# Altium schematic sheet Aux_Inputs.SchDoc: RP2040 CNC
size B; Author: AM; CompanyName: Expatria Technologies; DrawnBy: A.Marles; Engineer: AM; Organization: Expatria Technolgoies; DocumentNumber: 7; SheetNumber: 7; SheetTotal: 14
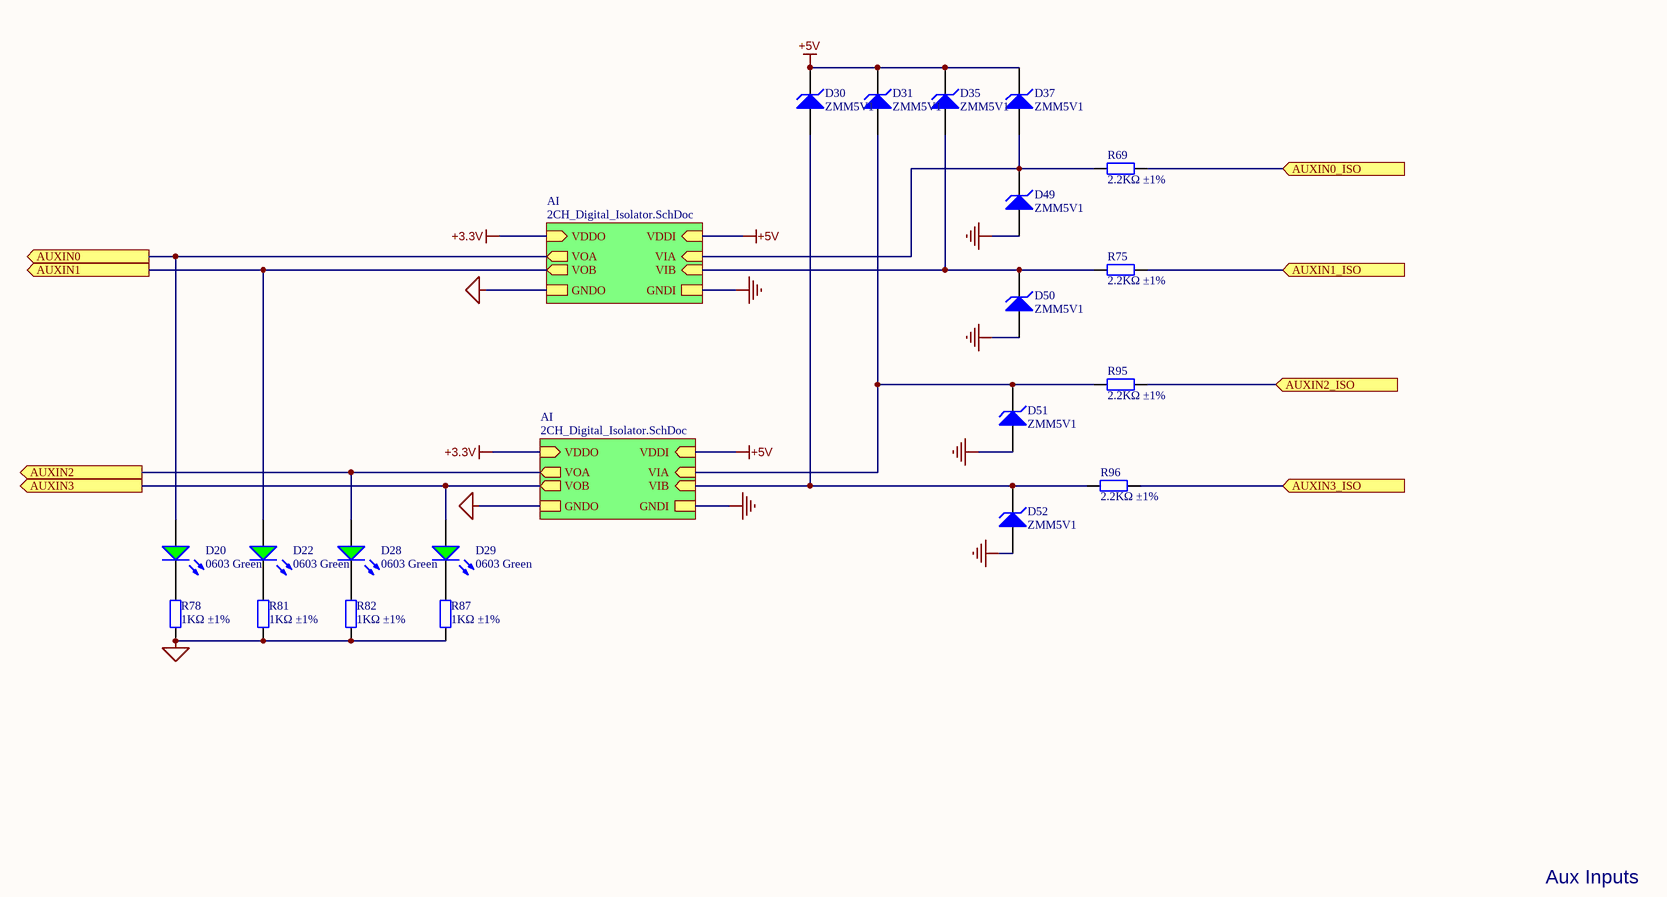
[diagram p0: Aux_Inputs.SchDoc]

## Parts
D20  0603 Green  [0603_LED_S1]
D22  0603 Green  [0603_LED_S1]
D28  0603 Green  [0603_LED_S1]
D29  0603 Green  [0603_LED_S1]
D30  ZMM5V1  [LL-34]
D31  ZMM5V1  [LL-34]
D35  ZMM5V1  [LL-34]
D37  ZMM5V1  [LL-34]
D49  ZMM5V1  [LL-34]
D50  ZMM5V1  [LL-34]
D51  ZMM5V1  [LL-34]
D52  ZMM5V1  [LL-34]
R69  2.2KΩ ±1%  [0603_R]
R75  2.2KΩ ±1%  [0603_R]
R78  1KΩ ±1%  [0603_R]
R81  1KΩ ±1%  [0603_R]
R82  1KΩ ±1%  [0603_R]
R87  1KΩ ±1%  [0603_R]
R95  2.2KΩ ±1%  [0603_R]
R96  2.2KΩ ±1%  [0603_R]

## Sub-sheets
AI = 2CH_Digital_Isolator.SchDoc: VDDO (in), VIB (in), VIA (in), VOB (out), VOA (out), VDDI (in), GNDO, GNDI
AI = 2CH_Digital_Isolator.SchDoc: VDDO (in), VIB (in), VIA (in), VOB (out), VOA (out), VDDI (in), GNDO, GNDI

## Ports
AUXIN0 (out), AUXIN0_ISO (in), AUXIN1 (out), AUXIN1_ISO (in), AUXIN2 (out), AUXIN2_ISO (in), AUXIN3 (out), AUXIN3_ISO (in)

## Nets
+3.3V: sheet AI/VDDO, sheet AI/VDDO
+5V: D30.2(K) D31.2(K) D35.2(K) D37.2(K) ; sheet AI/VDDI, sheet AI/VDDI
GND: D49.1(A) D50.1(A) D51.1(A) D52.1(A) ; sheet AI/GNDI, sheet AI/GNDI
MCU_GND: R78.2 R81.2 R82.2 R87.2 ; sheet AI/GNDO, sheet AI/GNDO
AUXIN0: D20.A ; port AUXIN0, sheet AI/VOA
AUXIN0_ISO: R69.1 ; port AUXIN0_ISO
AUXIN1: D22.A ; port AUXIN1, sheet AI/VOB
AUXIN1_ISO: R75.1 ; port AUXIN1_ISO
AUXIN2: D28.A ; port AUXIN2, sheet AI/VOA
AUXIN2_ISO: R95.1 ; port AUXIN2_ISO
AUXIN3: D29.A ; port AUXIN3, sheet AI/VOB
AUXIN3_ISO: R96.1 ; port AUXIN3_ISO
NetD20_K: D20.K R78.1
NetD22_K: D22.K R81.1
NetD28_K: D28.K R82.1
NetD29_K: D29.K R87.1
NetD30_1: D30.1(A) D52.2(K) R96.2 ; sheet AI/VIB
NetD31_1: D31.1(A) D51.2(K) R95.2 ; sheet AI/VIA
NetD35_1: D35.1(A) D50.2(K) R75.2 ; sheet AI/VIB
NetD37_1: D37.1(A) D49.2(K) R69.2 ; sheet AI/VIA

## Notes on the sheet
- Aux Inputs
- SHEET
- Expatria Technologies
- 1136 Glade Court
- Port Coquitlam, BC V3B 1R5
- PROJECT
- SIZE
- ENGR
- MODIFIED
- DOCUMENT
- REV
- Copyright Expatria Technologies 2022. This document describes Open Hardware and is licensed under the CERN-OHL-S v2. No warranty is implied or expressed.
- EMAIL: INFO@EXPATRIA.CA
- B
- /

## Library data of the parts
D20 D22 D28 D29 = 0603 LED Green: LED; ComponentLink1Description: 供应商链接; ComponentLink1URL: http://www.szlcsc.com/product/details_73152.html; Package: 0603; Supplier: LC; SuppliersPartNumber: C72043; Color: Green
D30 D31 D35 D37 D49-D52 = LL-34 ZMM5V6: 500mW - 0.1uA @ 1V 5.1V LL-34 Zener Diodes ROHS; ComponentLink1Description: 供应商链接; ComponentLink1URL: http://www.szlcsc.com/product/details_8541.html; Package: LL-34; Supplier: LC; SuppliersPartNumber: C2982194
R69 R75 R95 R96 = 0603 2.2K (2201) 1%: Chip resistor; Manufacturer: Uniroyal Elec; PartNumber: 0603WAF2201T5E; Power: 1/10W; ComponentLink1Description: Supplier link; ComponentLink1URL: http://www.szlcsc.com/product/details_4597.html; Package: 0603; Supplier: LC; SuppliersPartNumber: C4190; Resistance: 2.2KΩ; Tolerance: 1%
R78 R81 R82 R87 = 0603 1K (1001) 1%: Chip resistor; Manufacturer: Uniroyal Elec; PartNumber: 0603WAF1001T5E; Power: 1/10W; ComponentLink1Description: Supplier link; ComponentLink1URL: http://www.szlcsc.com/product/details_21904.html; Package: 0603; Supplier: LC; SuppliersPartNumber: C21190; Resistance: 1KΩ; Tolerance: 1%